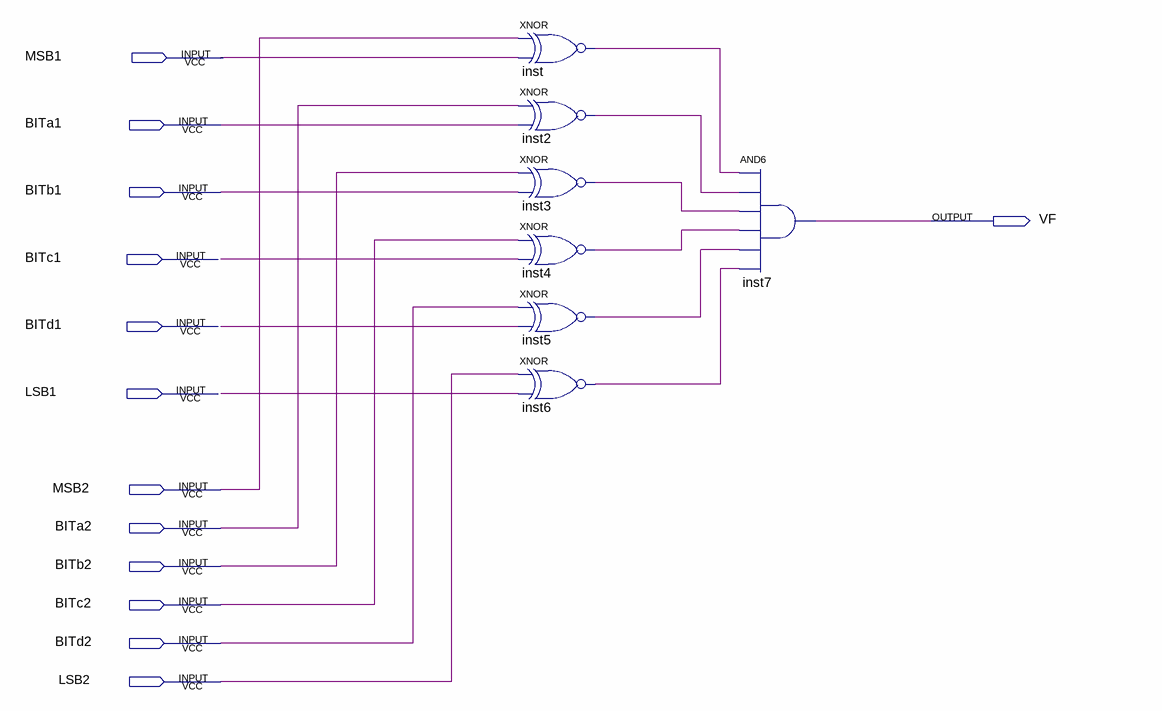
[diagram p0: schematic sheet]
// Quartus schematic Comparador.bdf as structural Verilog: 7 symbols, 13 pins
module Comparador (
  input  MSB1,
  input  BITa1,
  input  BITb1,
  input  BITc1,
  input  BITd1,
  input  LSB1,
  input  MSB2,
  input  BITa2,
  input  BITb2,
  input  BITc2,
  input  BITd2,
  input  LSB2,
  output VF
);

  wire inst2_out, inst3_out, inst4_out, inst5_out, inst6_out, inst_out;

  xnor inst (inst_out, MSB2, MSB1);
  xnor inst2 (inst2_out, BITa2, BITa1);
  xnor inst3 (inst3_out, BITb2, BITb1);
  xnor inst4 (inst4_out, BITc2, BITc1);
  xnor inst5 (inst5_out, BITd2, BITd1);
  xnor inst6 (inst6_out, LSB2, LSB1);
  and inst7 (VF, inst_out, inst2_out, inst3_out, inst4_out, inst5_out, inst6_out);
endmodule
